# Altium schematic sheet Power.SchDoc (part 2 of 2)
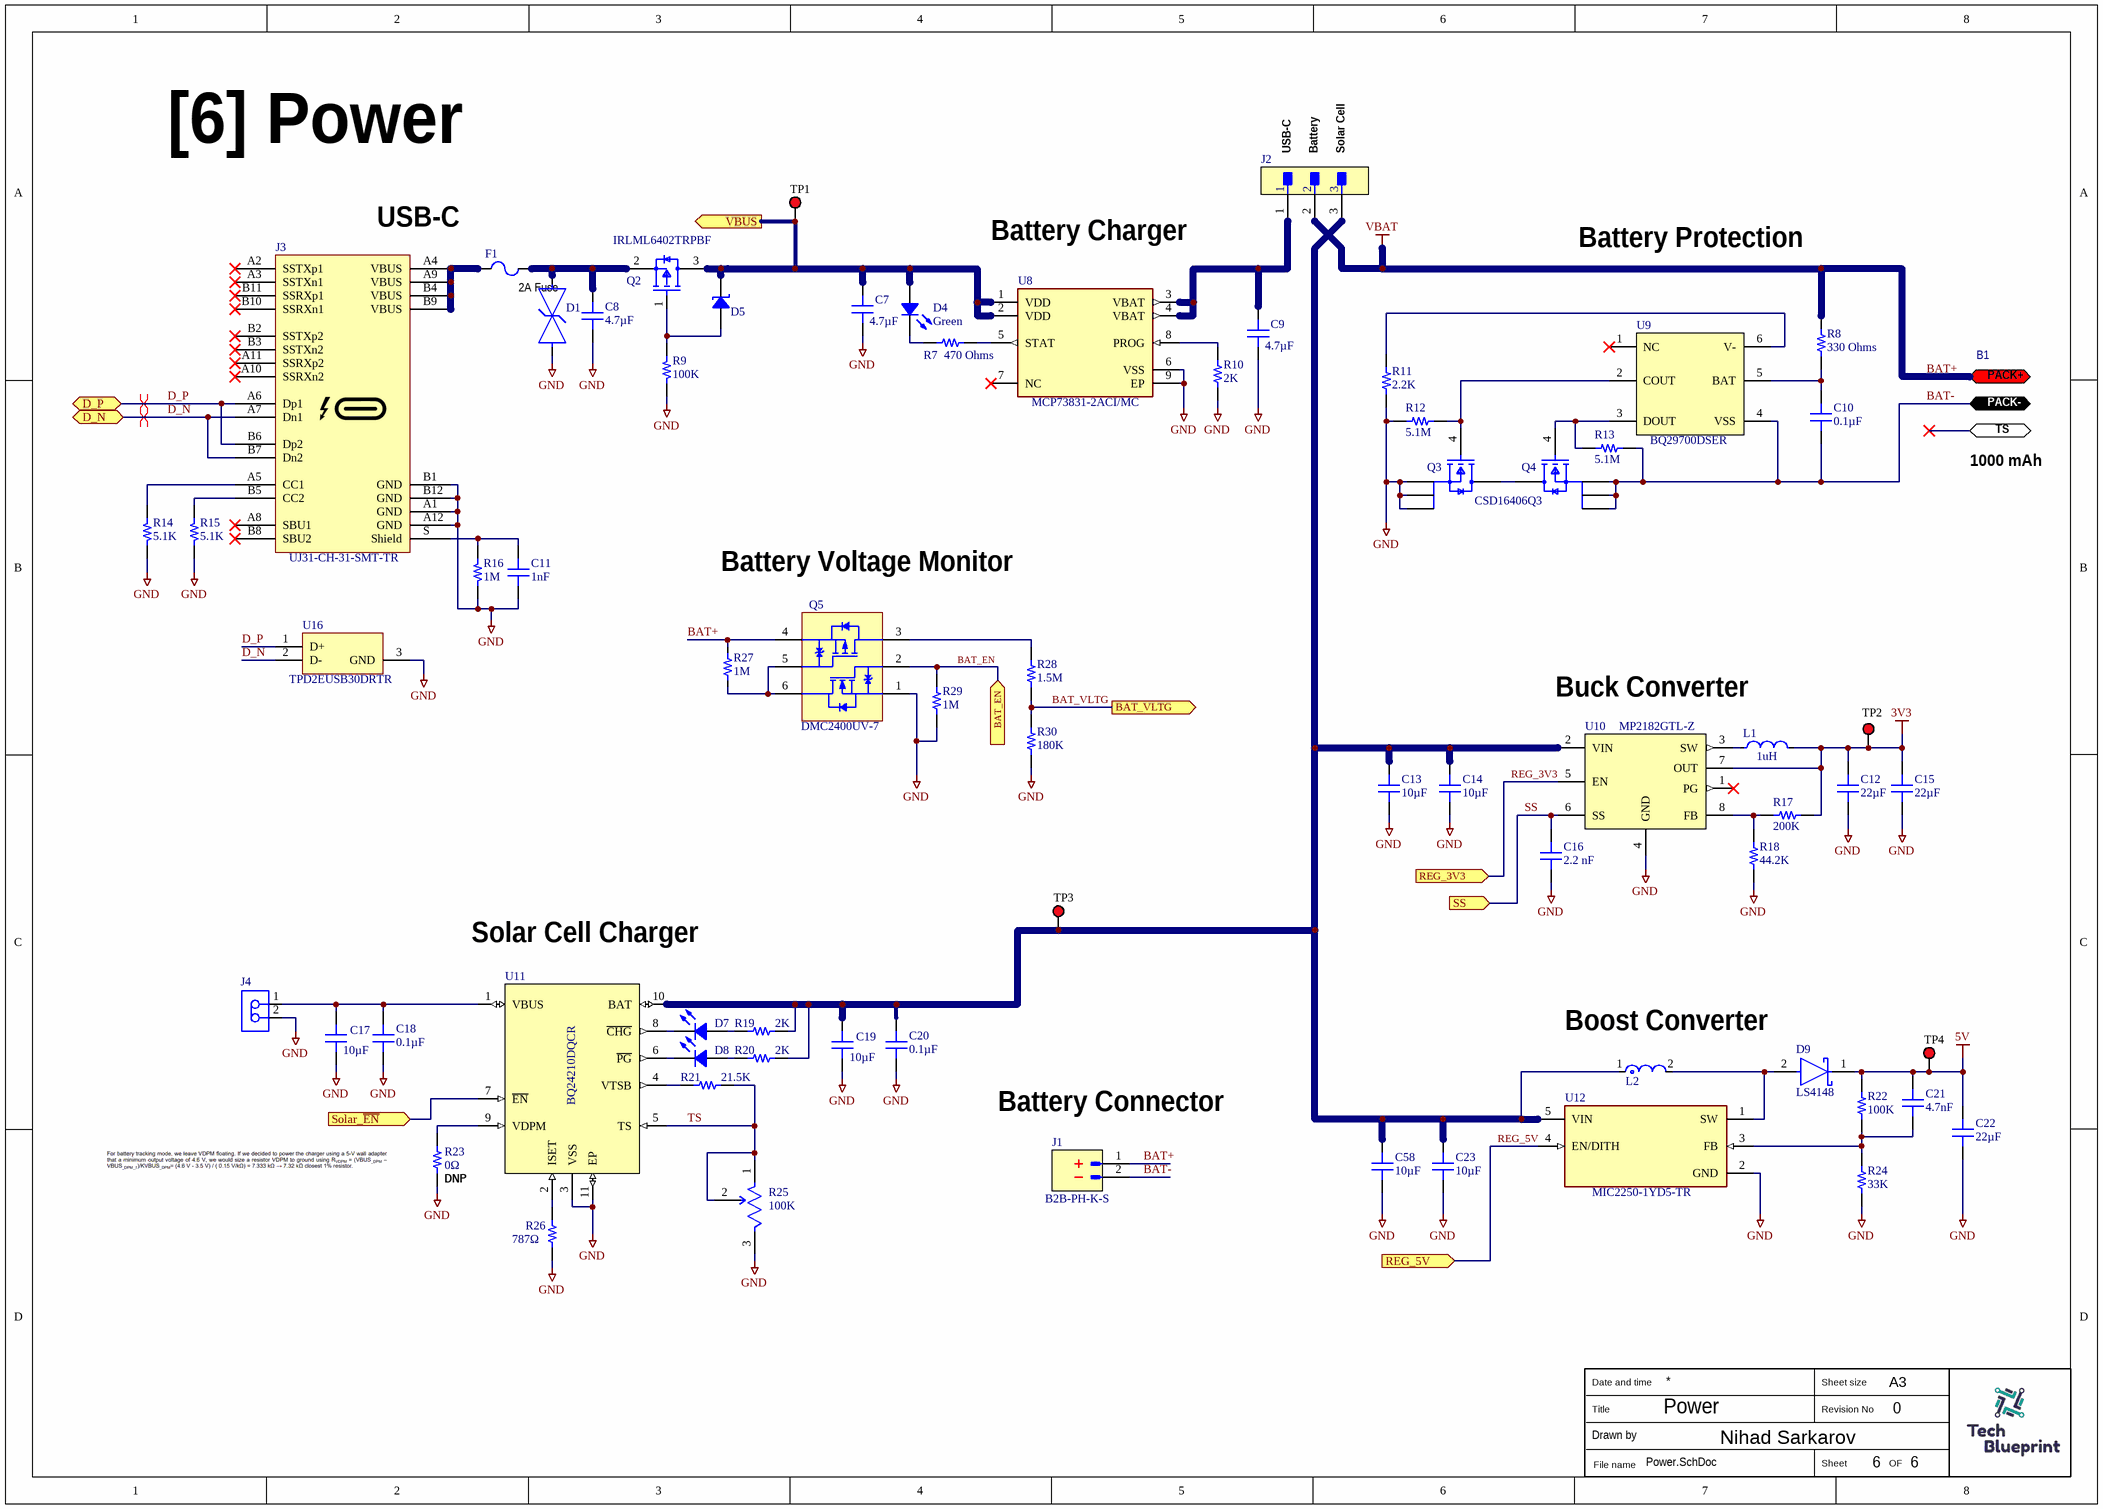
[diagram p1: Power.SchDoc]

## Library data of the parts
B1 = Battery: 1000 mAh
C7-C9 = 0805ZD475KAT2A: CAP CER 4.7UF 10V X5R 0805; manufacturer: AVX Corporation; Tolerance: ±10%; Part Number: 0805ZD475KAT2A; Capacitance: 4.7µF; Applications: General Purpose; componentlink1description: Datasheet; componentlink1url: http://datasheets.avx.com/cx5r.pdf; componentlink2description: DigiKey Link; componentlink2url: http://digikey.com/product-detail/en/avx-corporation/0805ZD475KAT2A/478-1415-1-ND/564447; Device Package: 0805 (2012 Metric); lastupdated: 9/2/2020 1:04:40 AM; Lifecycle Status: Active; Minimum Order: 1; Mounting Type: Surface Mount, MLCC; Operating Temperature: -55°C ~ 85°C; Package / Case: 0805 (2012 Metric); packaging: TapeAndReel; partid: 3139; Part Status: Active; price: 0.12; series: -; Size / Dimension: 0.079" L x 0.049" W (2.01mm x 1.25mm); Supplier 1: DigiKey; Supplier Part Number 1: 478-1415-1-ND; Temperature Coefficient: X5R; Thickness (Max): 0.055" (1.40mm); value: 4.7µF; Voltage - Rated: 10V
C10 C18 C20 = 08053C104KAT4A: CAP CER 0.1UF 25V X7R 0805; manufacturer: AVX Corporation; Tolerance: ±10%; Part Number: 08053C104KAT4A; Capacitance: 0.1µF; Applications: General Purpose; componentlink1description: Datasheet; componentlink1url: http://datasheets.avx.com/X7RDielectric.pdf; componentlink2description: DigiKey Link; componentlink2url: http://digikey.com/product-detail/en/avx-corporation/08053C104KAT4A/478-13052-1-ND/9948570; Device Package: 0805 (2012 Metric); lastupdated: 9/2/2020 1:04:37 AM; Lifecycle Status: Active; Minimum Order: 1; Mounting Type: Surface Mount, MLCC; Operating Temperature: -55°C ~ 125°C; Package / Case: 0805 (2012 Metric); packaging: TapeAndReel; partid: 5333; Part Status: Active; price: 0.02; series: -; Size / Dimension: 0.079" L x 0.049" W (2.01mm x 1.25mm); Supplier 1: DigiKey; Supplier Part Number 1: 478-13052-1-ND; Temperature Coefficient: X7R; Thickness (Max): 0.037" (0.94mm); value: 0.1µF; Voltage - Rated: 25V
C11 = C0805C102FAGECAUTO: CAP CER 0805 1NF 250V C0G 1%; manufacturer: KEMET; Temperature Coefficient: C0G, NP0; Part Number: C0805C102FAGECAUTO; Applications: Automotive, ESD Protection; componentlink1description: Datasheet; componentlink1url: https://connect.kemet.com:7667/gateway/IntelliData-ComponentDocumentation/1.0/download/datasheet/C0805C102FAGECAUTO; componentlink2description: DigiKey Link; componentlink2url: https://www.digikey.com/en/products/detail/kemet/C0805C102FAGECAUTO/8647301; Device Package: 0805 (2012 Metric); Features: Low ESL; lastupdated: 2/9/2024 8:14:47 PM; Lifecycle Status: Active; Minimum Order: 1; Mounting Type: Surface Mount, MLCC; Operating Temperature: -55°C ~ 125°C; Package / Case: 0805 (2012 Metric); packaging: TapeAndReel; partid: 49020; Part Status: Active; price: 0.31; Ratings: AEC-Q200; series: ESD SMD Auto C0G; Size / Dimension: 0.079" L x 0.049" W (2.00mm x 1.25mm); Supplier 1: DigiKey; Supplier Part Number 1: 399-C0805C102FAGECAUTOCT-ND; Thickness (Max): 0.039" (1.00mm); Tolerance: ±1%; value: 1000 pF; Voltage - Rated: 250V
C12 C15 C22 = 08056D226KAT2A: CAP CER 22UF 6.3V X5R 0805; manufacturer: AVX Corporation; Tolerance: ±10%; Part Number: 08056D226KAT2A; Capacitance: 22µF; Applications: General Purpose; componentlink1description: Datasheet; componentlink1url: http://datasheets.avx.com/cx5r.pdf; componentlink2description: DigiKey Link; componentlink2url: http://digikey.com/product-detail/en/avx-corporation/08056D226KAT2A/478-10069-1-ND/6564291; Device Package: 0805 (2012 Metric); lastupdated: 9/2/2020 1:04:40 AM; Lifecycle Status: Active; Minimum Order: 1; Mounting Type: Surface Mount, MLCC; Operating Temperature: -55°C ~ 85°C; Package / Case: 0805 (2012 Metric); packaging: TapeAndReel; partid: 3404; Part Status: Active; price: 0.18; series: -; Size / Dimension: 0.079" L x 0.049" W (2.01mm x 1.25mm); Supplier 1: DigiKey; Supplier Part Number 1: 478-10069-1-ND; Temperature Coefficient: X5R; Thickness (Max): 0.060" (1.52mm); value: 22µF; Voltage - Rated: 6.3V
C13 C14 C17 C19 C23 C58 = 0805ZD106KAT4A: CAP CER 10UF 10V X5R 0805; manufacturer: AVX Corporation; Tolerance: ±10%; Part Number: 0805ZD106KAT4A; Capacitance: 10µF; Applications: General Purpose; componentlink1description: Datasheet; componentlink1url: http://datasheets.avx.com/cx5r.pdf; componentlink2description: DigiKey Link; componentlink2url: http://digikey.com/product-detail/en/avx-corporation/0805ZD106KAT4A/478-10579-1-ND/6797452; Device Package: 0805 (2012 Metric); lastupdated: 9/2/2020 1:04:37 AM; Lifecycle Status: Active; Minimum Order: 1; Mounting Type: Surface Mount, MLCC; Operating Temperature: -55°C ~ 85°C; Package / Case: 0805 (2012 Metric); packaging: TapeAndReel; partid: 5023; Part Status: Active; price: 0.12; series: -; Size / Dimension: 0.079" L x 0.049" W (2.01mm x 1.25mm); Supplier 1: DigiKey; Supplier Part Number 1: 478-10579-1-ND; Temperature Coefficient: X5R; Thickness (Max): 0.055" (1.40mm); value: 10µF; Voltage - Rated: 10V
C16 = C0603C222K4RECAUTO: CAP CER 0603 2.2NF 16V X7R 10%; manufacturer: KEMET; Part Number: C0603C222K4RECAUTO; Applications: Automotive, ESD Protection; componentlink1description: Datasheet; componentlink1url: https://api.kemet.com/component-edge/download/datasheet/C0603C222K4RECAUTO.pdf; componentlink2description: DigiKey Link; componentlink2url: https://www.digikey.com/en/products/detail/kemet/C0603C222K4RECAUTO/8646528; Device Package: 0603 (1608 Metric); lastupdated: 2/9/2024 8:09:57 PM; Lifecycle Status: Active; Minimum Order: 1; Mounting Type: Surface Mount, MLCC; Operating Temperature: -55°C ~ 125°C; Package / Case: 0603 (1608 Metric); packaging: TapeAndReel; partid: 35311; Part Status: Active; price: 0.01; Ratings: AEC-Q200; series: ESD SMD Auto X7R; Size / Dimension: 0.063" L x 0.031" W (1.60mm x 0.80mm); Supplier 1: DigiKey; Supplier Part Number 1: 399-C0603C222K4RECAUTOCT-ND; Temperature Coefficient: X7R; Thickness (Max): 0.034" (0.87mm); Tolerance: ±10%; value: 2200 pF; Voltage - Rated: 16V
C21 = C0603C472K4RECAUTO: CAP CER 0603 4.7NF 16V X7R 10%; manufacturer: KEMET; Part Number: C0603C472K4RECAUTO; Applications: Automotive, ESD Protection; componentlink1description: Datasheet; componentlink1url: https://api.kemet.com/component-edge/download/datasheet/C0603C472K4RECAUTO.pdf; componentlink2description: DigiKey Link; componentlink2url: https://www.digikey.com/en/products/detail/kemet/C0603C472K4RECAUTO/8640473; Device Package: 0603 (1608 Metric); lastupdated: 2/9/2024 8:10:07 PM; Lifecycle Status: Active; Minimum Order: 1; Mounting Type: Surface Mount, MLCC; Operating Temperature: -55°C ~ 125°C; Package / Case: 0603 (1608 Metric); packaging: TapeAndReel; partid: 17340; Part Status: Active; price: 0.01; Ratings: AEC-Q200; series: ESD SMD Auto X7R; Size / Dimension: 0.063" L x 0.031" W (1.60mm x 0.80mm); Supplier 1: DigiKey; Supplier Part Number 1: 399-17879-1-ND; Temperature Coefficient: X7R; Thickness (Max): 0.034" (0.87mm); Tolerance: ±10%; value: 4700 pF; Voltage - Rated: 16V
D1 = CMP-00287-39618349-1: EZA-EG3A50AV EZAEG Series 100 Vcl 0.1 pF 0603 Surface Mount ESD Suppressor; Max Voltage Rating (DC): 30V; Polarity: Bidirectional; Number of Channels: 1; Breakdown Voltage: 15V; Leakage Current: 2mA; Working Voltage: 500V; ESD Protection: Yes; Capacitance: 100fF; Clamping Voltage: 100V; Element Configuration: Single; Current Rating: 3A; REACH SVHC: Unknown; Case Code (Imperial): 0603; Number of Circuits: 1; Voltage Rating: 15V; Mount: Surface Mount; Height: 600µm; Voltage Rating (AC): 15V; Lifecycle Status: Production; Radiation Hardening: No; Width: 787.4µm; Min Operating Temperature: -55°C; Max Operating Temperature: 125°C; Schedule B: 8536300000, 8536300000; Case/Package: 0603; Termination: SMD/SMT; Voltage Rating (DC): 15V; Lead Free: Lead Free; Depth: 800µm; Length: 1.6mm; Number of Pins: 2; RoHS: Compliant; Direction: Bidirectional; Operating Supply Voltage: 30V
D4 D8 = LSM0603453V: LED GREEN CLEAR CHIP 0603 SMD; Manufacturer: Visual Communications Company - VCC; Configuration: Standard; Current - Test: 20mA; Lens Color: Colorless; Lens Size: 1.20mm x 0.80mm; Lens Style: Rectangle with Flat Top; Millicandela Rating: 63mcd; Viewing Angle: 120°; Voltage - Forward (Vf) (Typ): 2V; Wavelength - Dominant: 572nm; Wavelength - Peak: 571nm; Part Number: LSM0603453V; Color: Green; ComponentLink1Description: Datasheet; ComponentLink1URL: https://vcclite.com/wp-content/uploads/wpallimport/files/files/LSM0603453V.pdf; ComponentLink2Description: DigiKey Link; ComponentLink2URL: https://www.digikey.com/en/products/detail/visual-communications-company-vcc/LSM0603453V/9486724; Device Package: 0603 (1608 Metric); Height (Max): 0.65mm; LastUpdated: 6/3/2024 7:58:54 PM; Lens Transparency: Clear; Lifecycle Status: Active; Minimum Order: 1; Mounting Type: Surface Mount; Package / Case: 0603 (1608 Metric); Packaging: TapeAndReel; PartId: 579; Part Status: Active; Price: 0.09; Series: LSM0603; Size / Dimension: 1.60mm L x 0.80mm W; Supplier 1: DigiKey; Supplier Part Number 1: LSM0603453VCT-ND; Supplier Device Package: Chip LED; Value: Green
D5 = PZU3.0B2A,115: DIODE ZENER 3V 320MW SOD323; Manufacturer: Nexperia USA Inc.; Current - Reverse Leakage @ Vr: 10 µA @ 1 V; Impedance (Max) (Zzt): 95 Ohms; Tolerance: ±2%; Voltage - Forward (Vf) (Max) @ If: 1.1 V @ 100 mA; Part Number: PZU3.0B2A,115; ComponentLink1Description: Datasheet; ComponentLink1URL: https://assets.nexperia.com/documents/data-sheet/PZUXBA_SER.pdf; ComponentLink2Description: DigiKey Link; ComponentLink2URL: https://www.digikey.com/en/products/detail/nexperia-usa-inc/PZU3-0B2A-115/2119995; LastUpdated: 6/3/2024 8:20:25 PM; Lifecycle Status: Active; Minimum Order: 1; Mounting Type: Surface Mount; Operating Temperature: -55°C ~ 150°C; Package / Case: SC-76, SOD-323; Packaging: TapeAndReel; PartId: 4239; Part Status: Active; Power - Max: 320 mW; Price: 0.02; Series: -; Supplier 1: DigiKey; Supplier Part Number 1: 1727-PZU3.0B2A,115CT-ND; Supplier Device Package: SOD-323; Voltage - Zener (Nom) (Vz): 3 V
D7 = QBLP601-R5-2897: 0603 LED RED 620NM DOMINANT,630N; Manufacturer: QT Brightek (QTB); Configuration: Standard; Current - Test: 5mA; Lens Color: Colorless; Lens Size: 1.10mm x 0.80mm; Lens Style: Rectangle with Flat Top; Lens Transparency: Clear; Millicandela Rating: 90mcd; Viewing Angle: 140°; Voltage - Forward (Vf) (Typ): 1.9V; Wavelength - Peak: 630nm; Part Number: QBLP601-R5-2897; Color: Red; ComponentLink1Description: Datasheet; ComponentLink1URL: https://www.qt-brightek.com/datasheet/QBLP601-R5-2897.pdf; ComponentLink2Description: DigiKey Link; ComponentLink2URL: https://www.digikey.com/en/products/detail/qt-brightek-qtb/QBLP601-R5-2897/22106649; Device Package: 0603 (1608 Metric); Height (Max): 0.70mm; LastUpdated: 6/3/2024 7:59:37 PM; Lifecycle Status: Active; Minimum Order: 1; Mounting Type: Surface Mount; Package / Case: 0603 (1608 Metric); Packaging: TapeAndReel; PartId: 1463; Price: 0.05; Series: QBLP601; Size / Dimension: 1.60mm L x 0.80mm W; Supplier 1: DigiKey; Supplier Part Number 1: 1516-QBLP601-R5-2897CT-ND; Supplier Device Package: 0603; Value: Red; Wavelength - Dominant: 620nm
D9 = CMP-02539-000014-1: DIODE GEN PURP 75V 150MA SOD80; Manufacturer: Vishay; Manufacturer Part Number: LS4148-GS18; Capacitance: 4pF; Max Surge Forward Current: 2A; Forward Current: 300mA; Max Repetitive Reverse Voltage: 100V; Max Junction Temp: +175°C; Peak Reverse Current: 5uA; Value: 4pF; Automotive Grade: Grade 0; Device Class L2: Diodes; Digikey Description: DIODE GEN PURP 75V 150MA SOD80; Lead Free: Yes; Device Class L1: Discrete Semiconductors; Mouser Description: In a Pack of 100, Vishay Switching Diode, 300mA 75V, 2-Pin SOD-80 LS4148-GS18; Package: 6.560-5006.01-4; RoHS: TRUE; Temperature Range High: +175°C; ComponentLink2URL: http://www.vishay.com/docs/85561/ls4148.pdf; Temperature: to +175°C; Device Class L3: Schottky Diodes; Automotive: Yes; ComponentLink2Description: Datasheet; Reverse Voltage: 75V; Height: 1.7mm; Category: Diode; Octopart: https://octopart.com/ls4148-gs18-vishay-55507867
F1 = 3413.0219.22: FUSE BRD MNT 2A 32VAC 63VDC 1206; Manufacturer: Schurter Inc.; Approval Agency: cURus, VDE; Breaking Capacity @ Rated Voltage: 63A; Fuse Type: Board Mount (Cartridge Style Excluded); Melting I²t: 0.79; Response Time: Fast Blow; Voltage Rating - AC: 32V; Voltage Rating - DC: 63V; Part Number: 3413.0219.22; Approvals: cURus, VDE; ComponentLink1Description: Datasheet; ComponentLink1URL: https://us.schurter.com/pdf/english/typ_USI_1206.pdf; ComponentLink2Description: DigiKey Link; ComponentLink2URL: http://digikey.com/product-detail/en/schurter-inc/3413.0219.22/486-1147-1-ND/1522979; Current Rating (Amps): 2A; Device Package: 1206 (3216 Metric); LastUpdated: 9/2/2020 1:30:41 AM; Lifecycle Status: Active; Minimum Order: 1; Mounting Type: Surface Mount; Operating Temperature: -55°C ~ 90°C; Package / Case: 1206 (3216 Metric); Packaging: TapeAndReel; Part Status: Active; Price: 0.26; Series: USI 1206; Size / Dimension: 0.126" L x 0.063" W x 0.024" H (3.20mm x 1.60mm x 0.60mm); Supplier 1: DigiKey; Supplier Part Number 1: 486-1147-1-ND
J1 = B2B-PH-K-S: MF: {'manufacturer': u'JST Sales'}; Package: None; Price: None; Value: *; MP: B2B-PH-K-S; Availability: Unavailable
J2 = CMP-2000-05697-2: CONN HEADER VERT 3POS 2.54MM; Number of Positions: 3; Gasket: No (Without); High Speed Serial Data Connector: No; Current Rating: 3A; Contact Post Length: 0.125inch; PCB Thickness: 1.397mm; PCB Mount Retention: Without; Connector Type: Plug; Approvals: CSA; PCB Mounting Orientation: Vertical; Pitch: 2.54mm; Mating Alignment: No (Without); Housing Color: Black; Contact Gender: Male; Length: 7.21mm; Max Operating Temperature: 105°C; Strain Relief: No (Without); Contact Material: Bronze; Row Spacing: 2.54mm; Series: AMPMODU MOD II; Board Standoff: No (Without); Package Quantity: 520; Radiation Hardening: No; Contact Protection: No (Without); Stabilizers: No (Without); Number of Rows: 1; Contact Mating Length: 8.08mm; Contact Shape: Square; Depth: 2.54mm; Contact Current Rating: 3A; Flammability Rating: UL94 V-0; Packaging: Carton; Number of Contacts: 3; Orientation: Straight; Mount: Through Hole; Keyed: No; Contact Type: Male Pin; Housing Material: Thermoplastic; High Temperature Housing: No; ELV: Compliant; Contact Plating: Gold; Termination: Through Hole; Selectively Loaded: No (Without); Lead Free: Lead Free; Min Operating Temperature: -65°C; Mating Connector Lock: No (Without); Color: Black; RoHS Compliant: Yes
J3 = UJ31-CH-31-SMT-TR: CONN RCPT USB3.1 TYPEC 24POS R/A; Manufacturer: CUI Devices; Connector Type: USB - C (Type - C); Current Rating (Amps): 0.25A, 1.25A, 5A, 6.25A; Gender: Receptacle; Mating Cycles: 10000; Number of Contacts: 24; Number of Ports: 1; Shielding: Shielded; Specifications: USB 3.1 (USB 3.1 Gen 2, Superspeed+); Voltage - Rated: 20V; Part Number: UJ31-CH-31-SMT-TR; ComponentLink1Description: Datasheet; ComponentLink1URL: https://www.cuidevices.com/product/resource/digikeypdf/uj31-ch-smt.pdf; ComponentLink2Description: DigiKey Link; ComponentLink2URL: http://digikey.com/product-detail/en/cui-devices/UJ31-CH-31-SMT-TR/102-4485-1-ND/8024065; Features: Board Guide; LastUpdated: 5/24/2020 10:49:54 PM; Lifecycle Status: Active; Minimum Order: 1; Mounting Feature: Horizontal; Mounting Type: Surface Mount, Right Angle; Through Hole; Operating Temperature: -30°C ~ 85°C; Packaging: TapeAndReel; Part Status: Active; Price: 0.89; Series: UJ31; Supplier 1: DigiKey; Supplier Part Number 1: 102-4485-1-ND; Termination: Solder
J4 = CMP-2000-05417-1: Male Header, Pitch 2.54 mm, 1 x 2 Position, Height 10.49 mm, Tail Length 3.556 mm, -55 to 105 degC, RoHS, Bulk; Manufacturer: TE Connectivity; Standards: RoHSCompliant,ELVCompliant,UL94V-0; Material, Housing: Polyester; Agency Approvals: CSA,UL; Brand/Series: MTA-100Series; Contact Centerline Spacing: 0.100 / in.; Material, Contact: CopperAlloy; Current, Rating: 5 / A; Color, Housing: White; Contact Termination Area Plating: Tin; Special Features: Pinstrip; Number of Positions: 2; Pin Spacing: 0.1 / "; Temperature, Operating: -55to+105 / degC; Angle: Straight; Mount Angle: Vertical; Connector Type: MTA-100; Primary Type: InterconnectSystem; Voltage, Rating: 250 / V; Mounting Hole Size: 0.04 / "; Number of Rows: 1; Termination: Solder; Length, Terminal Post: 0.14 / in.; Manufacturer URL: http://www.te.com/; Color: White; Size, Post: 0.025 / in.; Contact Shape: Square; Mounting Type: PCMount; Datasheet URL: https://datasheet.ciiva.com/11746/0900766b80eb7fdd-11746365.pdf; Type: PCBPlug; Datasheet Version: Rev. W, 06/2004; Number of Contacts: 2; Flammability Rating: UL94V-0; Contact Plating: Tin; Length, Pin: 0.14 / "; Contact Mating Area Plating: Tin; Length, Overall: 0.2 / "
L1 = CMP-06042-014115-1: Shielded Wirewound Inductor 1uH 20% 3000mA 0.059Ω 1008 (2520); Test Frequency: 1MHz; Current Rating: 3A; DC Resistance (DCR): 59mR; Core Material: Ferrite; Packaging: Tape and Reel; Case Code (Metric): 2520; Min Operating Temperature: -40°C; Max Operating Temperature: 85°C; Mount: Surface Mount; Case/Package: 1008; Width: 0.079inch; Resistor Type: Wirewound; Height - Seated (Max): 0.047inch; Case Code (Imperial): 1008; Tolerance: 20%; Length: 0.098inch; Shielding: Shielded
L2 = CMP-11268-000169-1: INDUCTOR, SHLD, 100UH, 20%, 0.35A, SMD; Core Material: Ferrite; Self Resonant Frequency: 10MHz; Shielding: Shielded; Saturation Current: 360mA; DC Resistance (DCR): 1.4R; Max DC Current: 370mA; RMS Current (Irms): 350mA; Test Frequency: 100kHz; Max Operating Temperature: 85°C; Width: 4mm; Length: 4mm; Min Operating Temperature: -40°C; Packaging: Cut Tape; Termination: SMD/SMT; Inductance Tolerance: 20%; REACH SVHC: No SVHC; Tolerance: 20%; Package Quantity: 1; Inductance: 100uH; Weight: 0.003527oz; Height: 1.7mm
Q2 = CMP-32901-000130-1: MOSFET P-CH 20V 3.7A SOT-23; Manufacturer: Infineon; Reverse Recovery Time: 29ns; Max Forward Diode Voltage: -1.2V; Input Capacitace At Vds: 633pF @ -10V; Drain To Source Resistance: 0.05Ω; Gate To Source Voltage: 12V; Max Junction Temp: +150°C; Pulse Drain Current: -22A; Threshold Vgs Min: -0.4V; Turn Off Delay Time: 588ns; Number Of Channels: 1; Power Dissipation: 1.3W; Turn On Delay Time: 350ns; Drain To Source Breakdown Voltage: -20V; Continuous Drain Current: -3.7A; Depletion Mode: False; Gate Charge At Vgs: 8nC @ -5V; Rthja Max: 75°C/W; Threshold Vgs: -0.55V; Standoff Height: 0.01mm; Reverse Recovery Charge: 11nC; Device Class L2: Transistors; Ipc Land Pattern Name: SOT95P237X100-3; Temperature Range High: +150°C; Octopart: https://octopart.com/irlml6402trpbf-infineon-65874989; ComponentLink2URL: https://www.infineon.com/dgdl/irlml6402pbf.pdf?fileId=5546d462533600a401535668d5c2263c; Automotive: No; Manufacturer Part Number: IRLML6402TRPBF; Height: 1.12mm; Drain To Source Voltage: -20V; Digikey Description: MOSFET P-CH 20V 3.7A SOT-23; Device Class L1: Discrete Semiconductors; Package: Micro3; Lead Free: Yes; Temperature Range Low: -55°C; Number Of P Channels: 1; Technology: MOSFET; Temperature: -55°C to +150°C; Category: Trans; Footprint Url: http://irf.com/package/outline/po_micro3.pdf; RoHS: TRUE; Device Class L3: MOSFETs; Threshold Vgs Max: -1.2V; ComponentLink2Description: Datasheet
Q3 Q4 = CMP-04962-000044-1: MOSFET N-CH 25V 60A 8-SON; Nominal Vgs: 1.7V; Power Dissipation: 2.7W; Element Configuration: Single; Input Capacitance: 1.1nF; Turn-Off Delay Time: 8.5ns; Number of Elements: 1; Rise Time: 12.9ns; Turn-On Delay Time: 7.3ns; Rds On Max: 5.3mR; Polarity: N-CHANNEL; Gate to Source Voltage (Vgs): 16V; Fall Time: 4.8ns; REACH SVHC: No SVHC; Max Operating Temperature: 150°C; Lead Free: Contains Lead; Contact Plating: Tin; Radiation Hardening: No; Series: NexFET™; Dual Supply Voltage: 25V; Mount: Surface Mount; Continuous Drain Current (ID): 60A; Threshold Voltage: 1.7V; RoHS Compliant: Yes; Package Quantity: 1; Min Operating Temperature: -55°C; Packaging: Tape and Reel; Number of Pins: 8; Termination: SMD/SMT; Max Power Dissipation: 2.7W; Case/Package: SON; Drain to Source Breakdown Voltage: 25V; Drain to Source Voltage (Vdss): 25V
Q5 = CMP-2000-06168-1: Complementary Pair Enhancement Mode MOSFET, 20 V N-Channel, -20 V P-Channel, -55 to 150 degC, 6-Pin SOTFL (SOT563), RoHS, Tape and Reel; Manufacturer: Diodes Inc; Channel Type: N,P; Maximum Power Dissipation: 1W; Typical Gate Charge @ Vgs: 0.5nC@4.5V; Typical Input Capacitance @ Vds: 37.1pF@10V; Maximum Gate Source Voltage: ±12(Q1)V,±8(Q2)V; Maximum Drain Source Resistance: 1.5Ω; Transistor Material: Si; Maximum Continuous Drain Current: 0.7A,1A; Typical Turn-Off Delay Time: 13.74ns; Number of Elements per Chip: 2; Maximum Drain Source Voltage: 20V; Maximum Gate Threshold Voltage: 1V; Transistor Configuration: Isolated; Typical Turn-On Delay Time: 4.06ns; Length: 1.7mm; Height: 0.6mm; Width: 1.25mm; Pin Count: 6; Minimum Operating Temperature: -55°C; Dimensions: 1.7x1.25x0.6mm; Package Type: SOT-563; Category: PowerMOSFET; Maximum Operating Temperature: +150°C; Manufacturer URL: http://www.diodes.com/; Channel Mode: Enhancement; Package Reference: SOT563-6; Mounting Technology: SurfaceMount; Datasheet URL: http://www.diodes.com/_files/datasheets/DMC2400UV.pdf; Package Description: 6-Pin Small Outline Transistor, Flat Lead, Body 1.175 x 1.6 mm, Pitch 0.5 mm; Mounting Type: SurfaceMount; Datasheet Version: Rev. 7-2, 06/2013
R7 = RMCF0603JT470R: RES 470 OHM 5% 1/10W 0603; Manufacturer: Stackpole Electronics Inc; Power (Watts): 0.1W, 1/10W; Temperature Coefficient: ±200ppm/°C; Part Number: RMCF0603JT470R; Value: 470 Ohms; ComponentLink1Description: Datasheet; ComponentLink1URL: https://www.seielect.com/catalog/sei-rmcf_rmcp.pdf; ComponentLink2Description: DigiKey Link; ComponentLink2URL: https://www.digikey.com/en/products/detail/stackpole-electronics-inc/RMCF0603JT470R/1757954; Composition: Thick Film; Device Package: 0603 (1608 Metric); Features: Automotive AEC-Q200; Height - Seated (Max): 0.022" (0.55mm); LastUpdated: 2/9/2024 8:43:33 PM; Lifecycle Status: Active; Minimum Order: 1; Number of Terminations: 2; Operating Temperature: -55°C ~ 155°C; Package / Case: 0603 (1608 Metric); Packaging: CutTape; PartId: 5857; Part Status: Active; Price: 0.01; Ratings: AEC-Q200; Resistance: 470 Ohms; Series: RMCF; Size / Dimension: 0.061" L x 0.031" W (1.55mm x 0.80mm); Supplier 1: DigiKey; Supplier Part Number 1: RMCF0603JT470RCT-ND; Supplier Device Package: 0603; Tolerance: ±5%
R8 = CRCW0805330RJNEAC: RES 330 OHM 5% 1/8W 0805; Manufacturer: Vishay Dale; Power (Watts): 0.125W, 1/8W; Temperature Coefficient: ±200ppm/°C; Part Number: CRCW0805330RJNEAC; Value: 330 Ohms; ComponentLink1Description: Datasheet; ComponentLink1URL: http://www.vishay.com/docs/28773/crcwce3.pdf; ComponentLink2Description: DigiKey Link; ComponentLink2URL: https://www.digikey.com/en/products/detail/vishay-dale/CRCW0805330RJNEAC/7928590; Composition: Thick Film; Device Package: 0805 (2012 Metric); Height - Seated (Max): 0.024" (0.60mm); LastUpdated: 2/8/2024 9:01:59 PM; Lifecycle Status: Active; Minimum Order: 1; Number of Terminations: 2; Operating Temperature: -55°C ~ 155°C; Package / Case: 0805 (2012 Metric); Packaging: TapeAndReel; PartId: 37144; Part Status: Active; Price: 0.01; Resistance: 330 Ohms; Series: CRCW-C; Size / Dimension: 0.079" L x 0.049" W (2.00mm x 1.25mm); Supplier 1: DigiKey; Supplier Part Number 1: 541-4168-1-ND; Supplier Device Package: 0805; Tolerance: ±5%
R9 R22 = CRGP0805F100K: RES 100K OHM 1% 1/3W 0805; Manufacturer: TE Connectivity Passive Product; Power (Watts): 0.333W, 1/3W; Resistance: 100 kOhms; Temperature Coefficient: ±100ppm/°C; Part Number: CRGP0805F100K; Value: 100K; ComponentLink1Description: Datasheet; ComponentLink1URL: https://www.te.com/commerce/DocumentDelivery/DDEController?Action=srchrtrv&DocNm=9-1773463-9&DocType=DS&DocLang=English; ComponentLink2Description: DigiKey Link; ComponentLink2URL: https://www.digikey.com/en/products/detail/te-connectivity-passive-product/CRGP0805F100K/8577103; Composition: Thick Film; Device Package: 0805 (2012 Metric); Features: Pulse Withstanding; Height - Seated (Max): 0.026" (0.65mm); LastUpdated: 2/8/2024 9:02:34 PM; Lifecycle Status: Active; Minimum Order: 1; Number of Terminations: 2; Operating Temperature: -55°C ~ 155°C; Package / Case: 0805 (2012 Metric); Packaging: TapeAndReel; PartId: 28747; Part Status: Active; Price: 0.02; Series: CRGP; Size / Dimension: 0.079" L x 0.049" W (2.00mm x 1.25mm); Supplier 1: DigiKey; Supplier Part Number 1: A130501CT-ND; Supplier Device Package: 0805; Tolerance: ±1%
R10 = RC0603FR-072KP: RES 2K OHM 1% 1/10W 0603; Manufacturer: Yageo; Power (Watts): 0.1W, 1/10W; Ratings: 7C1 RoHS w/out Exemption (100% Pb-Free); Resistance: 2 kOhms; Temperature Coefficient: ±100ppm/°C; Part Number: RC0603FR-072KP; Value: 2K; ComponentLink1Description: Datasheet; ComponentLink1URL: http://www.yageo.com/NewPortal/yageodocoutput?fileName=/pdf/R-Chip/PYu-RC_51_RoHS_P_0.pdf; ComponentLink2Description: DigiKey Link; ComponentLink2URL: https://www.digikey.com/en/products/detail/yageo/RC0603FR-072KP/4935312; Composition: Thick Film; Device Package: 0603 (1608 Metric); Features: Moisture Resistant; Height - Seated (Max): 0.022" (0.55mm); LastUpdated: 7/25/2024 9:19:32 AM; Lifecycle Status: Active; Minimum Order: 1; Number of Terminations: 2; Operating Temperature: -55°C ~ 155°C; Package / Case: 0603 (1608 Metric); Packaging: TapeAndReel; PartId: 6623; Part Status: Active; Price: 0.01; Series: RC_P; Size / Dimension: 0.063" L x 0.031" W (1.60mm x 0.80mm); Supplier 1: DigiKey; Supplier Part Number 1: YAG1297CT-ND; Supplier Device Package: 0603; Tolerance: ±1%
R11 = RCC08052K20FKEA: RCC0805 100 2K2 1% ET1 E3; Manufacturer: Vishay Dale; Power (Watts): 0.25W, 1/4W; Resistance: 2.2 kOhms; Temperature Coefficient: ±100ppm/°C; Part Number: RCC08052K20FKEA; Value: 2.2K; ComponentLink1Description: Datasheet; ComponentLink1URL: https://www.vishay.com/docs/20066/rcce3.pdf; ComponentLink2Description: DigiKey Link; ComponentLink2URL: https://www.digikey.com/en/products/detail/vishay-dale/RCC08052K20FKEA/12084242; Composition: Thick Film; Device Package: 0805 (2012 Metric); Features: Automotive AEC-Q200; Height - Seated (Max): 0.020" (0.50mm); LastUpdated: 2/8/2024 9:00:23 PM; Lifecycle Status: Active; Minimum Order: 1; Number of Terminations: 2; Operating Temperature: -55°C ~ 155°C; Package / Case: 0805 (2012 Metric); Packaging: TapeAndReel; PartId: 68039; Part Status: Active; Price: 0.02; Ratings: AEC-Q200; Series: RCC e3; Size / Dimension: 0.079" L x 0.049" W (2.00mm x 1.25mm); Supplier 1: DigiKey; Supplier Part Number 1: 541-RCC08052K20FKEACT-ND; Supplier Device Package: 0805; Tolerance: ±1%
R12 R13 = ESR10EZPJ515: RES SMD 5.1M OHM 5% 0.4W 0805; Manufacturer: Rohm Semiconductor; Power (Watts): 0.4W, 2/5W; Resistance: 5.1 MOhms; Temperature Coefficient: ±200ppm/°C; Part Number: ESR10EZPJ515; Value: 5.1M; ComponentLink1Description: Datasheet; ComponentLink1URL: https://www.rohm.com/datasheet/ESR01MZPF/esr-e; ComponentLink2Description: DigiKey Link; ComponentLink2URL: https://www.digikey.com/en/products/detail/rohm-semiconductor/ESR10EZPJ515/4051343; Composition: Thick Film; Device Package: 0805 (2012 Metric); Features: Automotive AEC-Q200, Pulse Withstanding; Height - Seated (Max): 0.026" (0.65mm); LastUpdated: 2/8/2024 9:02:31 PM; Lifecycle Status: Active; Minimum Order: 1; Number of Terminations: 2; Operating Temperature: -55°C ~ 155°C; Package / Case: 0805 (2012 Metric); Packaging: TapeAndReel; PartId: 29452; Part Status: Active; Price: 0.01; Ratings: AEC-Q200; Series: ESR; Size / Dimension: 0.079" L x 0.049" W (2.00mm x 1.25mm); Supplier 1: DigiKey; Supplier Part Number 1: RHM5.1MKCT-ND; Supplier Device Package: 0805; Tolerance: ±5%
R14 R15 = SG73S2ATTD512J: RES 5.1K OHM 5% 1/4W 0805; Manufacturer: KOA Speer Electronics, Inc.; Power (Watts): 0.25W, 1/4W; Resistance: 5.1 kOhms; Temperature Coefficient: ±200ppm/°C; Part Number: SG73S2ATTD512J; Value: 5.1K; ComponentLink1Description: Datasheet; ComponentLink1URL: https://www.koaspeer.com/pdfs/SG73S.pdf; ComponentLink2Description: DigiKey Link; ComponentLink2URL: https://www.digikey.com/en/products/detail/koa-speer-electronics-inc/SG73S2ATTD512J/10292985; Composition: Thick Film; Device Package: 0805 (2012 Metric); Features: Automotive AEC-Q200, Moisture Resistant, Pulse Withstanding; Height - Seated (Max): 0.024" (0.60mm); LastUpdated: 7/25/2024 9:45:12 AM; Lifecycle Status: Active; Minimum Order: 1; Number of Terminations: 2; Operating Temperature: -55°C ~ 155°C; Package / Case: 0805 (2012 Metric); Packaging: TapeAndReel; PartId: 82922; Price: 0.01; Ratings: AEC-Q200; Series: SG73S; Size / Dimension: 0.079" L x 0.049" W (2.00mm x 1.25mm); Supplier 1: DigiKey; Supplier Part Number 1: 2019-SG73S2ATTD512JCT-ND; Supplier Device Package: 0805; Tolerance: ±5%
R16 = RCS08051M00FKEA: RES SMD 1M OHM 1% 1/2W 0805; Manufacturer: Vishay Dale; Power (Watts): 0.5W, 1/2W; Resistance: 1 MOhms; Temperature Coefficient: ±100ppm/°C; Part Number: RCS08051M00FKEA; Value: 1M; ComponentLink1Description: Datasheet; ComponentLink1URL: http://www.vishay.com/docs/20065/rcse3.pdf; ComponentLink2Description: DigiKey Link; ComponentLink2URL: https://www.digikey.com/en/products/detail/vishay-dale/RCS08051M00FKEA/5866999; Composition: Thick Film; Device Package: 0805 (2012 Metric); Features: Automotive AEC-Q200, Pulse Withstanding; Height - Seated (Max): 0.020" (0.50mm); LastUpdated: 2/8/2024 9:02:38 PM; Lifecycle Status: Active; Minimum Order: 1; Number of Terminations: 2; Operating Temperature: -55°C ~ 155°C; Package / Case: 0805 (2012 Metric); Packaging: TapeAndReel; PartId: 27791; Part Status: Active; Price: 0.02; Ratings: AEC-Q200; Series: RCS e3; Size / Dimension: 0.079" L x 0.049" W (2.00mm x 1.25mm); Supplier 1: DigiKey; Supplier Part Number 1: 541-2853-1-ND; Supplier Device Package: 0805; Tolerance: ±1%
R17 = RC0805FR-07200KL: RES 200K OHM 1% 1/8W 0805; Manufacturer: Yageo; Power (Watts): 0.125W, 1/8W; Resistance: 200 kOhms; Temperature Coefficient: ±100ppm/°C; Part Number: RC0805FR-07200KL; Value: 200K; ComponentLink1Description: Datasheet; ComponentLink1URL: https://www.yageo.com/upload/media/product/productsearch/datasheet/rchip/PYu-RC_Group_51_RoHS_L_10.pdf; ComponentLink2Description: DigiKey Link; ComponentLink2URL: https://www.digikey.com/en/products/detail/yageo/RC0805FR-07200KL/727724; Composition: Thick Film; Device Package: 0805 (2012 Metric); Features: Moisture Resistant; Height - Seated (Max): 0.024" (0.60mm); LastUpdated: 7/25/2024 9:20:25 AM; Lifecycle Status: Active; Minimum Order: 1; Number of Terminations: 2; Operating Temperature: -55°C ~ 155°C; Package / Case: 0805 (2012 Metric); Packaging: TapeAndReel; PartId: 32602; Part Status: Active; Price: 0.01; Series: RC_L; Size / Dimension: 0.079" L x 0.049" W (2.00mm x 1.25mm); Supplier 1: DigiKey; Supplier Part Number 1: 311-200KCRCT-ND; Supplier Device Package: 0805; Tolerance: ±1%
R18 = RK73H2ATTD4422F: RES 44.2K OHM 1% 1/4W 0805; Manufacturer: KOA Speer Electronics, Inc.; Power (Watts): 0.25W, 1/4W; Resistance: 44.2 kOhms; Temperature Coefficient: ±100ppm/°C; Part Number: RK73H2ATTD4422F; Value: 44.2K; ComponentLink1Description: Datasheet; ComponentLink1URL: http://www.koaspeer.com/catimages/Products/RK73H/RK73H.pdf; ComponentLink2Description: DigiKey Link; ComponentLink2URL: https://www.digikey.com/en/products/detail/koa-speer-electronics-inc/RK73H2ATTD4422F/10234510; Composition: Thick Film; Device Package: 0805 (2012 Metric); Features: Automotive AEC-Q200; Height - Seated (Max): 0.024" (0.60mm); LastUpdated: 7/25/2024 9:45:17 AM; Lifecycle Status: Active; Minimum Order: 1; Number of Terminations: 2; Operating Temperature: -55°C ~ 155°C; Package / Case: 0805 (2012 Metric); Packaging: CutTape; PartId: 48356; Part Status: Active; Price: 0.01; Ratings: AEC-Q200; Series: RK73H; Size / Dimension: 0.079" L x 0.049" W (2.00mm x 1.25mm); Supplier 1: DigiKey; Supplier Part Number 1: 2019-RK73H2ATTD4422FCT-ND; Supplier Device Package: 0805; Tolerance: ±1%
R19 R20 = RMCF0603JT2K00: RES 2K OHM 5% 1/10W 0603; Manufacturer: Stackpole Electronics Inc; Power (Watts): 0.1W, 1/10W; Resistance: 2 kOhms; Temperature Coefficient: ±200ppm/°C; Part Number: RMCF0603JT2K00; Value: 2K; ComponentLink1Description: Datasheet; ComponentLink1URL: https://www.seielect.com/catalog/sei-rmcf_rmcp.pdf; ComponentLink2Description: DigiKey Link; ComponentLink2URL: https://www.digikey.com/en/products/detail/stackpole-electronics-inc/RMCF0603JT2K00/1757951; Composition: Thick Film; Device Package: 0603 (1608 Metric); Features: Automotive AEC-Q200; Height - Seated (Max): 0.022" (0.55mm); LastUpdated: 2/9/2024 8:43:32 PM; Lifecycle Status: Active; Minimum Order: 1; Number of Terminations: 2; Operating Temperature: -55°C ~ 155°C; Package / Case: 0603 (1608 Metric); Packaging: CutTape; PartId: 5994; Part Status: Active; Price: 0.01; Ratings: AEC-Q200; Series: RMCF; Size / Dimension: 0.061" L x 0.031" W (1.55mm x 0.80mm); Supplier 1: DigiKey; Supplier Part Number 1: RMCF0603JT2K00CT-ND; Supplier Device Package: 0603; Tolerance: ±5%
R21 = RCG080521K5FKEA: RCG0805 100 21K5 1% EA; Manufacturer: Vishay Dale; Power (Watts): 0.125W, 1/8W; Resistance: 21.5 kOhms; Temperature Coefficient: ±100ppm/°C; Part Number: RCG080521K5FKEA; Value: 21.5K; ComponentLink1Description: Datasheet; ComponentLink1URL: https://www.vishay.com/docs/20047/rcge3.pdf; ComponentLink2Description: DigiKey Link; ComponentLink2URL: https://www.digikey.com/en/products/detail/vishay-dale/RCG080521K5FKEA/13212777; Composition: Thick Film; Device Package: 0805 (2012 Metric); Height - Seated (Max): 0.020" (0.50mm); LastUpdated: 2/8/2024 9:00:36 PM; Lifecycle Status: Active; Minimum Order: 1; Number of Terminations: 2; Operating Temperature: -55°C ~ 155°C; Package / Case: 0805 (2012 Metric); Packaging: TapeAndReel; PartId: 61401; Part Status: Active; Price: 0.01; Series: RCG e3; Size / Dimension: 0.079" L x 0.049" W (2.00mm x 1.25mm); Supplier 1: DigiKey; Supplier Part Number 1: 541-RCG080521K5FKEACT-ND; Supplier Device Package: 0805; Tolerance: ±1%
R23 = CRCW0805787RFKEA: RES SMD 0 OHM 1% 1/8W 0805; Manufacturer: Vishay Dale; Power (Watts): 0.125W, 1/8W; Resistance: 787 Ohms; Temperature Coefficient: ±100ppm/°C; Part Number: CRCW0805787RFKEA; Value: 0Ω; ComponentLink1Description: Datasheet; ComponentLink1URL: http://www.vishay.com/docs/20035/dcrcwe3.pdf; ComponentLink2Description: DigiKey Link; ComponentLink2URL: https://www.digikey.com/en/products/detail/vishay-dale/CRCW0805787RFKEA/1175625; Composition: Thick Film; Device Package: 0805 (2012 Metric); Features: Automotive AEC-Q200; Height - Seated (Max): 0.020" (0.50mm); LastUpdated: 2/8/2024 9:02:35 PM; Lifecycle Status: Active; Minimum Order: 1; Number of Terminations: 2; Operating Temperature: -55°C ~ 155°C; Package / Case: 0805 (2012 Metric); Packaging: TapeAndReel; PartId: 28575; Part Status: Active; Price: 0.01; Ratings: AEC-Q200; Series: CRCW; Size / Dimension: 0.079" L x 0.049" W (2.00mm x 1.25mm); Supplier 1: DigiKey; Supplier Part Number 1: 541-787CCT-ND; Supplier Device Package: 0805; Tolerance: ±1%
R24 = CRGP0805F33K: RES 33K OHM 1% 1/3W 0805; Manufacturer: TE Connectivity Passive Product; Power (Watts): 0.333W, 1/3W; Resistance: 33 kOhms; Temperature Coefficient: ±100ppm/°C; Part Number: CRGP0805F33K; Value: 33K; ComponentLink1Description: Datasheet; ComponentLink1URL: https://www.te.com/commerce/DocumentDelivery/DDEController?Action=srchrtrv&DocNm=9-1773463-9&DocType=DS&DocLang=English; ComponentLink2Description: DigiKey Link; ComponentLink2URL: https://www.digikey.com/en/products/detail/te-connectivity-passive-product/CRGP0805F33K/8577097; Composition: Thick Film; Device Package: 0805 (2012 Metric); Features: Pulse Withstanding; Height - Seated (Max): 0.026" (0.65mm); LastUpdated: 2/8/2024 9:02:34 PM; Lifecycle Status: Active; Minimum Order: 1; Number of Terminations: 2; Operating Temperature: -55°C ~ 155°C; Package / Case: 0805 (2012 Metric); Packaging: TapeAndReel; PartId: 28737; Part Status: Active; Price: 0.02; Series: CRGP; Size / Dimension: 0.079" L x 0.049" W (2.00mm x 1.25mm); Supplier 1: DigiKey; Supplier Part Number 1: A130495CT-ND; Supplier Device Package: 0805; Tolerance: ±1%
R25 = CMP-07234-000040-1: TRIMMER 100K OHM 0.1W J LEAD TOP; Number of Turns: 1; Voltage Rating (DC): 50V; Power Rating: 100mW; Resistance Tolerance: 25%; Temperature Coefficient: 250ppm/°C; Max Operating Temperature: 100°C; Package Quantity: 2500; REACH SVHC: No SVHC; Termination: Foot Print; Packaging: Tape and Reel; RoHS Compliant: Yes; Military Standard: Not; Color: Silver; Width: 0.118inch; Min Operating Temperature: -40°C; Mount: Surface Mount; Height: 0.047inch; Tolerance: 25%; Resistor Type: Carbon; Length: 3mm; Depth: 3.8mm; Weight: 29.4mg; Max Power Dissipation: 100mW; Series: TC33; Radiation Hardening: No
R26 = CRCW0805787RFKEA: RES SMD 787 OHM 1% 1/8W 0805; Manufacturer: Vishay Dale; Power (Watts): 0.125W, 1/8W; Resistance: 787 Ohms; Temperature Coefficient: ±100ppm/°C; Part Number: CRCW0805787RFKEA; Value: 787Ω; ComponentLink1Description: Datasheet; ComponentLink1URL: http://www.vishay.com/docs/20035/dcrcwe3.pdf; ComponentLink2Description: DigiKey Link; ComponentLink2URL: https://www.digikey.com/en/products/detail/vishay-dale/CRCW0805787RFKEA/1175625; Composition: Thick Film; Device Package: 0805 (2012 Metric); Features: Automotive AEC-Q200; Height - Seated (Max): 0.020" (0.50mm); LastUpdated: 2/8/2024 9:02:35 PM; Lifecycle Status: Active; Minimum Order: 1; Number of Terminations: 2; Operating Temperature: -55°C ~ 155°C; Package / Case: 0805 (2012 Metric); Packaging: TapeAndReel; PartId: 28575; Part Status: Active; Price: 0.01; Ratings: AEC-Q200; Series: CRCW; Size / Dimension: 0.079" L x 0.049" W (2.00mm x 1.25mm); Supplier 1: DigiKey; Supplier Part Number 1: 541-787CCT-ND; Supplier Device Package: 0805; Tolerance: ±1%
R27 R29 = CRCW08051M00JNEAHP: RES SMD 1M OHM 5% 1/2W 0805; Manufacturer: Vishay Dale; Power (Watts): 0.5W, 1/2W; Resistance: 1 MOhms; Temperature Coefficient: ±200ppm/°C; Part Number: CRCW08051M00JNEAHP; Value: 1M; ComponentLink1Description: Datasheet; ComponentLink1URL: http://www.vishay.com/docs/20043/crcwhpe3.pdf; ComponentLink2Description: DigiKey Link; ComponentLink2URL: https://www.digikey.com/en/products/detail/vishay-dale/CRCW08051M00JNEAHP/2222402; Composition: Thick Film; Device Package: 0805 (2012 Metric); Features: Automotive AEC-Q200, Pulse Withstanding; Height - Seated (Max): 0.020" (0.50mm); LastUpdated: 2/8/2024 9:02:08 PM; Lifecycle Status: Active; Minimum Order: 1; Number of Terminations: 2; Operating Temperature: -55°C ~ 155°C; Package / Case: 0805 (2012 Metric); Packaging: TapeAndReel; PartId: 34838; Part Status: Active; Price: 0.02; Ratings: AEC-Q200; Series: CRCW-HP; Size / Dimension: 0.079" L x 0.049" W (2.00mm x 1.25mm); Supplier 1: DigiKey; Supplier Part Number 1: 541-1.0MTACT-ND; Supplier Device Package: 0805; Tolerance: ±5%
R28 = RMCF0805FT1M50: RES 1.5M OHM 1% 1/8W 0805; Manufacturer: Stackpole Electronics Inc; Power (Watts): 0.125W, 1/8W; Resistance: 1.5 MOhms; Temperature Coefficient: ±200ppm/°C; Part Number: RMCF0805FT1M50; Value: 1.5M; ComponentLink1Description: Datasheet; ComponentLink1URL: https://www.seielect.com/catalog/sei-rmcf_rmcp.pdf; ComponentLink2Description: DigiKey Link; ComponentLink2URL: https://www.digikey.com/en/products/detail/stackpole-electronics-inc/RMCF0805FT1M50/1712568; Composition: Thick Film; Device Package: 0805 (2012 Metric); Features: Automotive AEC-Q200; Height - Seated (Max): 0.026" (0.65mm); LastUpdated: 2/8/2024 9:02:21 PM; Lifecycle Status: Active; Minimum Order: 1; Number of Terminations: 2; Operating Temperature: -55°C ~ 155°C; Package / Case: 0805 (2012 Metric); Packaging: TapeAndReel; PartId: 31667; Part Status: Active; Price: 0.01; Ratings: AEC-Q200; Series: RMCF; Size / Dimension: 0.079" L x 0.049" W (2.00mm x 1.25mm); Supplier 1: DigiKey; Supplier Part Number 1: RMCF0805FT1M50CT-ND; Supplier Device Package: 0805; Tolerance: ±1%
R30 = CRGP0805F180K: RES 180K OHM 1% 1/3W 0805; Manufacturer: TE Connectivity Passive Product; Power (Watts): 0.333W, 1/3W; Resistance: 180 kOhms; Temperature Coefficient: ±100ppm/°C; Part Number: CRGP0805F180K; Value: 180K; ComponentLink1Description: Datasheet; ComponentLink1URL: https://www.te.com/commerce/DocumentDelivery/DDEController?Action=srchrtrv&DocNm=9-1773463-9&DocType=DS&DocLang=English; ComponentLink2Description: DigiKey Link; ComponentLink2URL: https://www.digikey.com/en/products/detail/te-connectivity-passive-product/CRGP0805F180K/8577106; Composition: Thick Film; Device Package: 0805 (2012 Metric); Features: Pulse Withstanding; Height - Seated (Max): 0.026" (0.65mm); LastUpdated: 2/8/2024 9:02:34 PM; Lifecycle Status: Active; Minimum Order: 1; Number of Terminations: 2; Operating Temperature: -55°C ~ 155°C; Package / Case: 0805 (2012 Metric); Packaging: TapeAndReel; PartId: 28751; Part Status: Active; Price: 0.02; Series: CRGP; Size / Dimension: 0.079" L x 0.049" W (2.00mm x 1.25mm); Supplier 1: DigiKey; Supplier Part Number 1: A130504CT-ND; Supplier Device Package: 0805; Tolerance: ±1%
TP1-TP4 = CMP-1672-00002-4: Test Point, Red, Through Hole, RoHS, Bulk; Manufacturer: Keystone; Contact Material: Bronze; Mounting Technology: Through Hole; RoHSCompliant: true; Pins: 1; Package Quantity: 100; ComponentLink2Description: Datasheet; Height: 8.12 mm; ComponentLink1URL: http://www.keyelco.com/; DatasheetVersion: Rev. F, 12/2013; Mount: Through Hole; PackageReference: 5010; Contact Plating: Silver; Packaging: Bulk; Colour: Red; REACH SVHC: No SVHC; PackageDescription: 1-Pin Through Hole Device, Dia 3.17 mm; ComponentLink2URL: http://www.keyelco.com/product-pdf.cfm?p=1319; ComponentLink1Description: Manufacturer URL
U8 = CMP-06318-000002-1: IC CONTROLLER LI-ION 4.2V 8DFN; Manufacturer: Microchip; Number Of Cells: 1; Min Supply Voltage: 3.75V; Standoff Height: 0mm; Nominal Supply Current: 0.1-510uA; Max Junction Temp: +125°C; Max Supply Voltage: 6V; Temperature Range High: +85°C; Mouser Description: Battery Management Li-Ion/Li-Poly Charg Mgnt 4.2V Vreg out; Device Class L2: Power Management ICs; ComponentLink2Description: Datasheet; Footprint Url: http://ww1.microchip.com/downloads/en/DeviceDoc/8L_DFN_2x3x0_9_MC_C04-123C.pdf; Output Voltage: 4.2V; ComponentLink2URL: http://ww1.microchip.com/downloads/en/DeviceDoc/20001984g.pdf; Package: C04-123; Ipc Land Pattern Name: DFN200X300X90-8; Number Of Outputs: 1; Manufacturer Part Number: MCP73831-2ACI/MC; Device Class L3: Battery Management; Device Class L1: Integrated Circuits (ICs); Digikey Description: IC CONTROLLER LI-ION 4.2V 8DFN; Category: IC; Temperature Range Low: -40°C; Automotive: No; Temperature: -40°C to +85°C; Octopart: https://octopart.com/mcp73831-2aci%2Fmc-microchip-16517355; RoHS: TRUE; Ambient Temperature Range Low: -40°C; Height: 1mm; Lead Free: Yes; Ambient Temperature Range High: +85°C
U9 = CMP-04911-000043-1: IC LITHIUM BATT PROTECT 6-SON; Number of Cells: 1; Fault Protection: Over Current; Operating Supply Voltage: 8V; Packaging: Tape and Reel; RoHS Compliant: Yes; Contact Plating: Gold; Lead Free: Lead Free; Min Operating Temperature: -40°C; Number of Pins: 6; Max Operating Temperature: 85°C; Package Quantity: 3000; Mount: Surface Mount; Weight: 0.000342oz
U10 = MP2182GTL-Z: Buck Switching Regulator IC Positive Adjustable 0.6V 1 Output 2A SOT-583; Mfr_Name: Monolithic Power Systems; RefDes: RefDes; Type: Type; Supplier 1: Mouser; Supplier Part Number 1: 946-MP2182GTL-Z
U11 = BQ24210DQCR: MF: {'manufacturer': u'Texas Instruments'}; Package: None; Price: None; Value: *; MP: BQ24210DQCR; Availability: Unavailable
U12 = CMP-06325-000043-1: IC REG BOOST ADJ 900MA SOT23-5; Synchronous Rectifier: No; Output Voltage: 32V; Number of Outputs: 1; Switching Frequency: 2.5MHz; Min Output Voltage: 1.24V; Max Output Current: 2A; Output Type: Adjustable; Min Input Voltage: 2.5V; Output Configuration: Positive; Efficiency: 80%; Max Input Voltage: 5.5V; Case/Package: SOT-23-5; Length: 2.9mm; Width: 1.6mm; Height: 0.87mm; Number of Pins: 5; Packaging: Tape and Reel; Max Operating Temperature: 125°C; Mount: Surface Mount; Package Quantity: 3000; Max Output Voltage: 32V; Output Current: 900mA; Series: -; RoHS Compliant: Yes; Min Operating Temperature: -40°C; Topology: Boost; Switching Frequency-Max: 2.5MHz
U16 = CMP-0326-00046-3: ESD Solution for Super-Speed (6 Gbps) USB 3.0 Interface, 2 Channels, -40 to +85 degC, 3-pin SOT (DRT), Green (Rohs & No Sb/Br); Manufacturer: Texas Instruments; Differential Capacitance(pF): 0.01; Breakdown Voltage(Min)(V): 9; HDMI: TRUE; IEC 61000-4-2 Air-Gap(+/- kV): 8; IO Leakage Current(nA): 10; IO Capacitance(Typ)(pF): 0.7; Mounting Technology: Surface Mount; PackageDescription: 3-Flat Lead Plastic Small Outline, 1 x 1 mm (inc leads), 0.35 mm Pitch; IEC 61000-4-2 Contact(+/- kV): 8; USB Super Speed: TRUE; Eco-Plan: Green (RoHS & no Sb/Br); USB High Speed: TRUE; PackageReference: DRT0003A; SubFamily: ESD Solution; USB Full Speed: TRUE; ComponentLink1Description: Datasheet; ComponentLink2URL: SamplesURL:http://www.ti.com/product/tpd2eusb30#samples; PackageVersion: revD, Jun-2008; ComponentLink2Description: URL Link1; 1394 / Firewire: TRUE; PartNumber: TPD2EUSB30DRTR; ComponentLink1URL: http://www.ti.com/general/docs/lit/getliterature.tsp?genericPartNumber=TPD2EUSB30&fileType=pdf; DatasheetVersion: SLVSAC2C; Serial ATA / eSATA: TRUE